# EAGLE design CHEAPO3 (EAGLE 6.3)
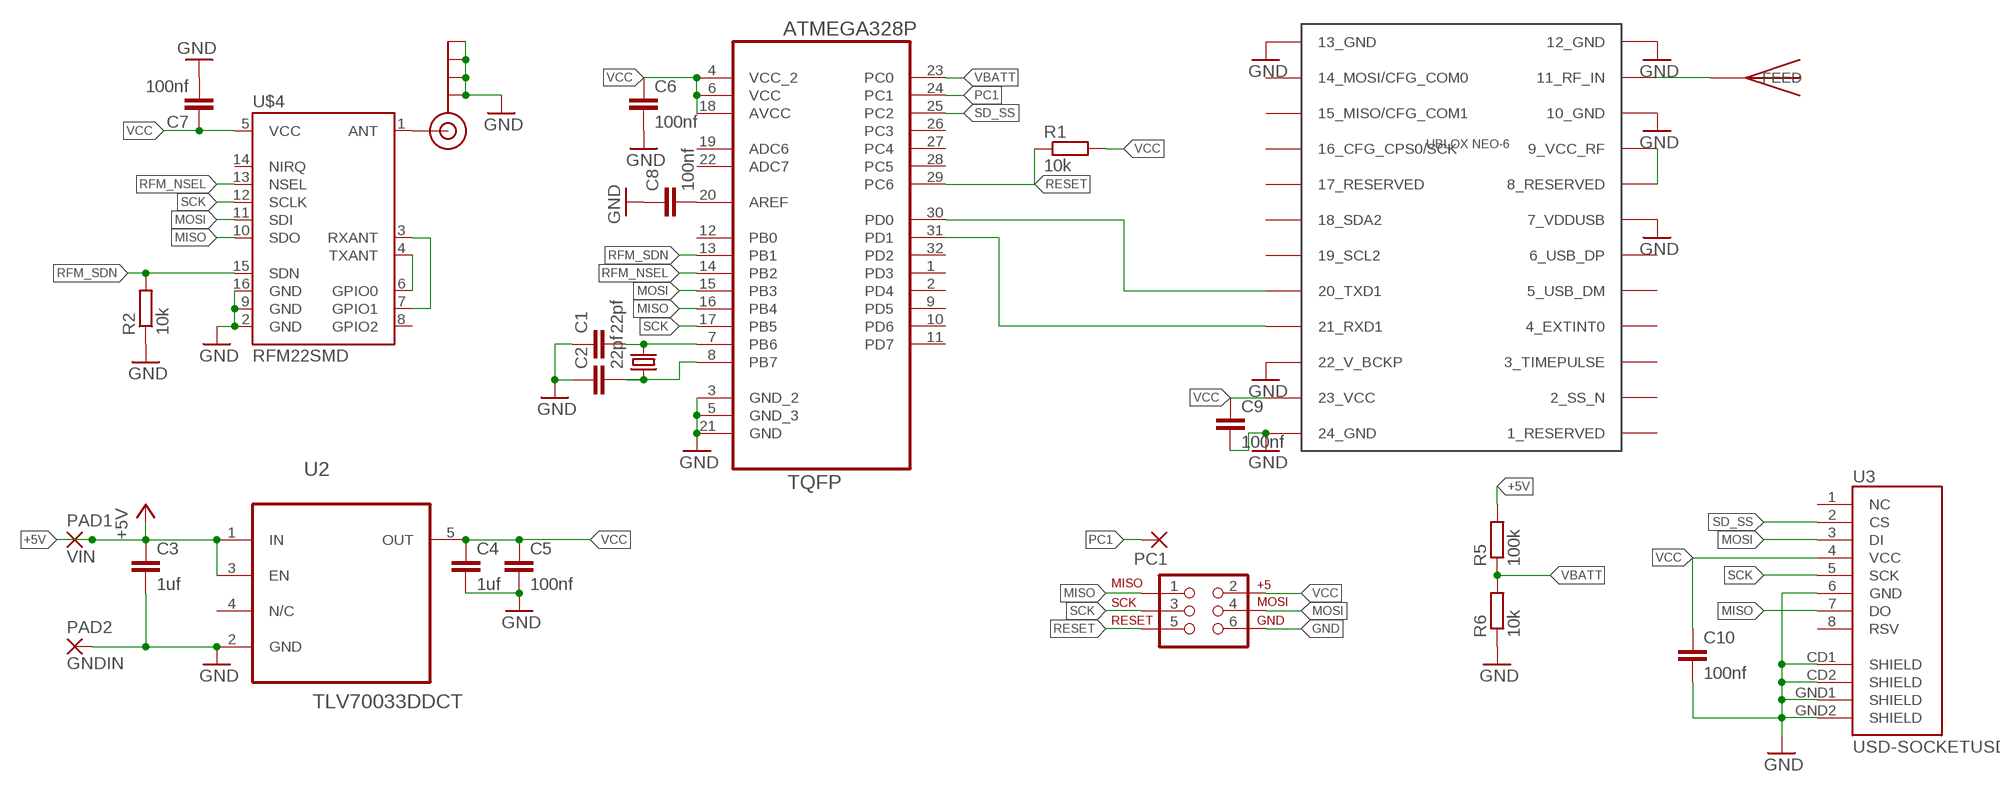
[diagram p0: schematic, sheet 1]

## Parts
C1  22pf  C-EUC0603  [C0603]
C2  22pf  C-EUC0603  [C0603]
C3  1uf  C-EUC0603  [C0603]
C4  1uf  C-EUC0603  [C0603]
C5  100nf  C-EUC0603  [C0603]
C6  100nf  C-EUC0603  [C0603]
C7  100nf  C-EUC0603  [C0603]
C8  100nf  C-EUC0603  [C0603]
C9  100nf  C-EUC0603  [C0603]
C10  100nf  C-EUC0603  [C0603]
J1  AVR_SPI_PRG_6PTH  [2X3]
J$1  SMA_EDGE  [SMA-EDGE]
PAD1  VIN  SMD2  [SMD1,27-2,54]
PAD2  GNDIN  SMD2  [SMD1,27-2,54]
PC1  SMD2  [SMD1,27-2,54]
R1  10k  R-EU_R0603  [R0603]
R2  10k  R-EU_R0603  [R0603]
R5  100k  R-EU_R0603  [R0603]
R6  10k  R-EU_R0603  [R0603]
U1  ATMEGA328P-AU  [QFP80P900X900X120-32N]
U2  TLV70033DDCT  [SOT95P280X110-5N]
U3  USD-SOCKETUSD  [USD-SOCKET-PP]
U$1  UBLOX_NEO-6  [UBLOX_NEO-6P]
U$2  ABRACON_ABM3_CRYSTALABM03_HC49  [ABM03_HC49]
U$3  JTI_ANTENNA-1575AT43A40  [JTI_ANTENNA-1575AT43A40]
U$4  RFM22SMD  [RFM22-XXX-S2]

## Nets
+5V: C3.1 PAD1.1(P) R5.2 U2.1(IN) U2.3(EN)
GND: C1.1 C2.1 C3.2 C4.2 C5.2 C6.2 C7.2 C8.1 C9.2 C10.2 J1.6 J$1.GND@0(GND) J$1.GND@1(GND) J$1.GND@2(GND) J$1.GND@3(GND) PAD2.1(P) R2.1 R6.1 U1.3(GND_2) U1.5(GND_3) U1.21(GND) U2.2(GND) U3.6(GND) U3.CD1(SHIELD) U3.CD2(SHIELD) U3.GND1(SHIELD) U3.GND2(SHIELD) U$1.7_VDDUSB U$1.10_GND U$1.12_GND U$1.13_GND U$1.22_V_BCKP U$1.24_GND U$4.2(GND) U$4.9(GND) U$4.16(GND)
MISO: J1.1 U1.16(PB4) U3.7(DO) U$4.10(SDO)
MOSI: J1.4 U1.15(PB3) U3.3(DI) U$4.11(SDI)
N$1: C1.2 U1.7(PB6) U$2.2
N$2: C2.2 U1.8(PB7) U$2.1
N$3: U$4.4(TXANT) U$4.6(GPIO0)
N$4: U$4.3(RXANT) U$4.7(GPIO1)
N$5: U$1.8_RESERVED U$1.9_VCC_RF
N$6: U$1.11_RF_IN U$3.FEED
N$7: C8.2 U1.20(AREF)
N$8: J$1.SIG(SIGNAL) U$4.1(ANT)
N$9: U1.30(PD0) U$1.20_TXD1
N$10: U1.31(PD1) U$1.21_RXD1
PC1: PC1.1(P) U1.24(PC1)
RESET: J1.5 R1.1 U1.29(PC6)
RFM_NSEL: U1.14(PB2) U$4.13(NSEL)
RFM_SDN: R2.2 U1.13(PB1) U$4.15(SDN)
SCK: J1.3 U1.17(PB5) U3.5(SCK) U$4.12(SCLK)
SD_SS: U1.25(PC2) U3.2(CS)
VBATT: R5.1 R6.2 U1.23(PC0)
VCC: C4.1 C5.1 C6.1 C7.1 C9.1 C10.1 J1.2 R1.2 U1.4(VCC_2) U1.6(VCC) U1.18(AVCC) U2.5(OUT) U3.4(VCC) U$1.23_VCC U$4.5(VCC)
Unconnected: U1.1(PD3) U1.2(PD4) U1.9(PD5) U1.10(PD6) U1.11(PD7) U1.12(PB0) U1.19(ADC6) U1.22(ADC7) U1.26(PC3) U1.27(PC4) U1.28(PC5) U1.32(PD2) U2.4(N/C) U3.1(NC) U3.8(RSV) U$1.1_RESERVED U$1.2_SS_N U$1.3_TIMEPULSE U$1.4_EXTINT0 U$1.5_USB_DM U$1.6_USB_DP U$1.14_MOSI/CFG_COM0 U$1.15_MISO/CFG_COM1 U$1.16_CFG_CPS0/SCK U$1.17_RESERVED U$1.18_SDA2 U$1.19_SCL2 U$4.8(GPIO2) U$4.14(NIRQ)

## Library data of the parts
C1-C10 = rcl:C-EU: CAPACITOR, European symbol
J1 = SparkFun-Connectors:AVR_SPI_PRG_6: AVR ISP 6 Pin This is the reduced ISP connector for AVR programming. Common on Arduino. This footprint will take up less PCB space and can be used with a 10-pin to 6-pin adapter such as SKU: BOB-08508
J$1 = SparkFun-Connectors:SMA_EDGE: SMA Antenna Connector End launch SMA connector. The paste layer has been removed so that the connector can be hand soldered onto the board after reflow.
PAD1 PAD2 PC1 = wirepad:SMD2: SMD PAD
R1 R2 R5 R6 = rcl:R-EU_: RESISTOR, European symbol
U1 = Ava:ATMEGA328P-AU; DESCRIPTION: 8-bit Microcontroller with In-System Programmable Flash; MPN: ATMEGA328P-AU; OC_FARNELL: 1715486; OC_NEWARK: 14R4631; PACKAGE: TQFP-32; SUPPLIER: Atmel
U2 = Texas Instruments_By_element14_Batch_1:TLV70033DDCT: 200-mA, Low-IQ, Low-Dropout Regulator for Portable Devices; MPN: TLV70033DDCT; OC_FARNELL: 1778230; OC_NEWARK: 50R4446; PACKAGE: TSOT-23-5; SUPPLIER: Texas Instruments
U3 = CSEDIT-SparkFun-Old:USD-SOCKET: microSD Socket Push-push type uSD socket. Schematic element and footprint production proven. Spark Fun Electronics SKU : PRT-00127. tDoc lines correctly indicate media card edge positions when inserting (unlocked, locked, depressed).
U$1 = Ava:UBLOX_NEO-6: UBLOX NEO-6 GPS MODULE Author Anthony Stirk / http://ava.upuaut.net http://www.u-blox.com/images/downloads/Product_Docs/LEA-6_NEO-6_MAX-6_HardwareIntegrationManual_%28GPS.G6-HW-09007%29.pdf http://www.u-blox.com/images/downloads/Product_Docs/NEO-6_DataSheet_%28GPS.G6-HW-09005%29.pdf
U$2 = Ava:ABRACON_ABM3_CRYSTAL
U$3 = Ava:JTI_ANTENNA-1575AT43A40
U$4 = SparkFun-RF:RFM22: The RFM22 is a low-power, low cost radio that is capable of operating in the 434MHz and 900MHz open bands. It's frequency is software defined and there are some very good libraries written for it.

## Board
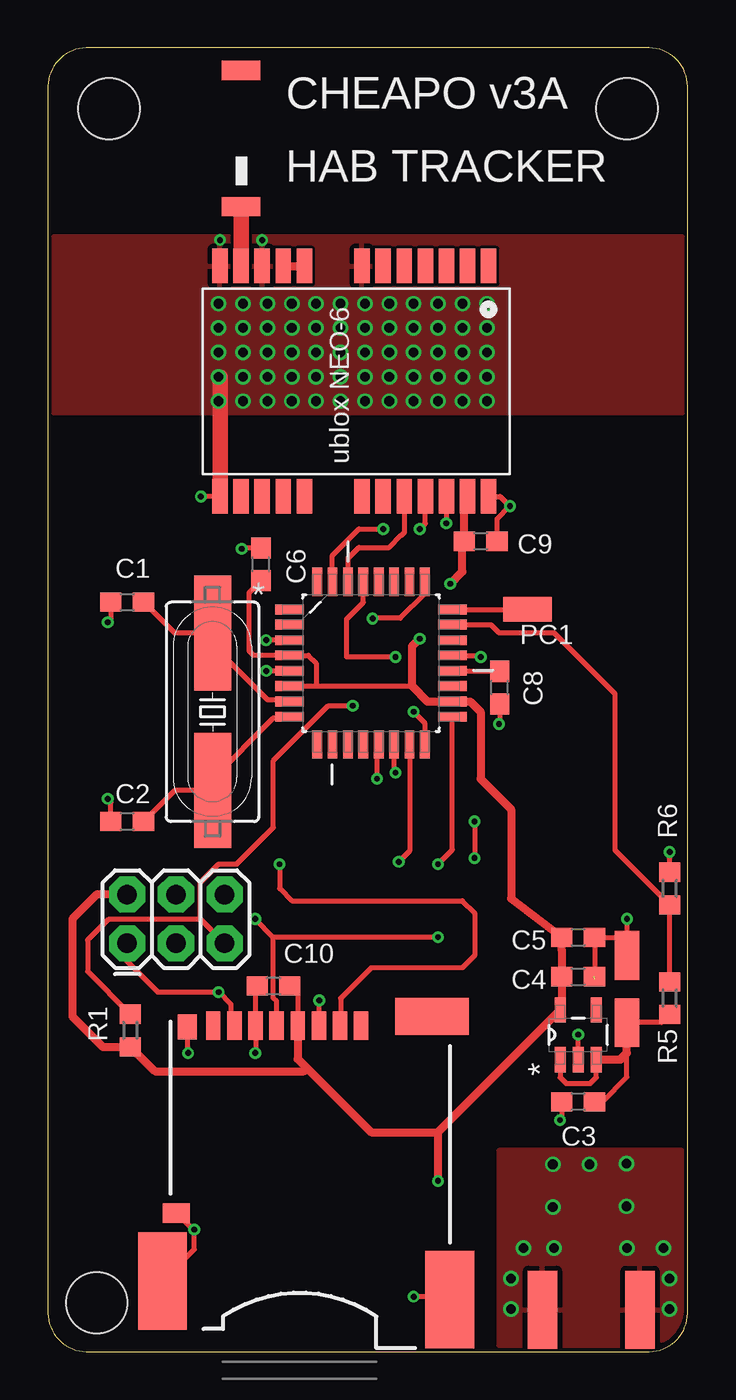
[diagram p1: board, top side]
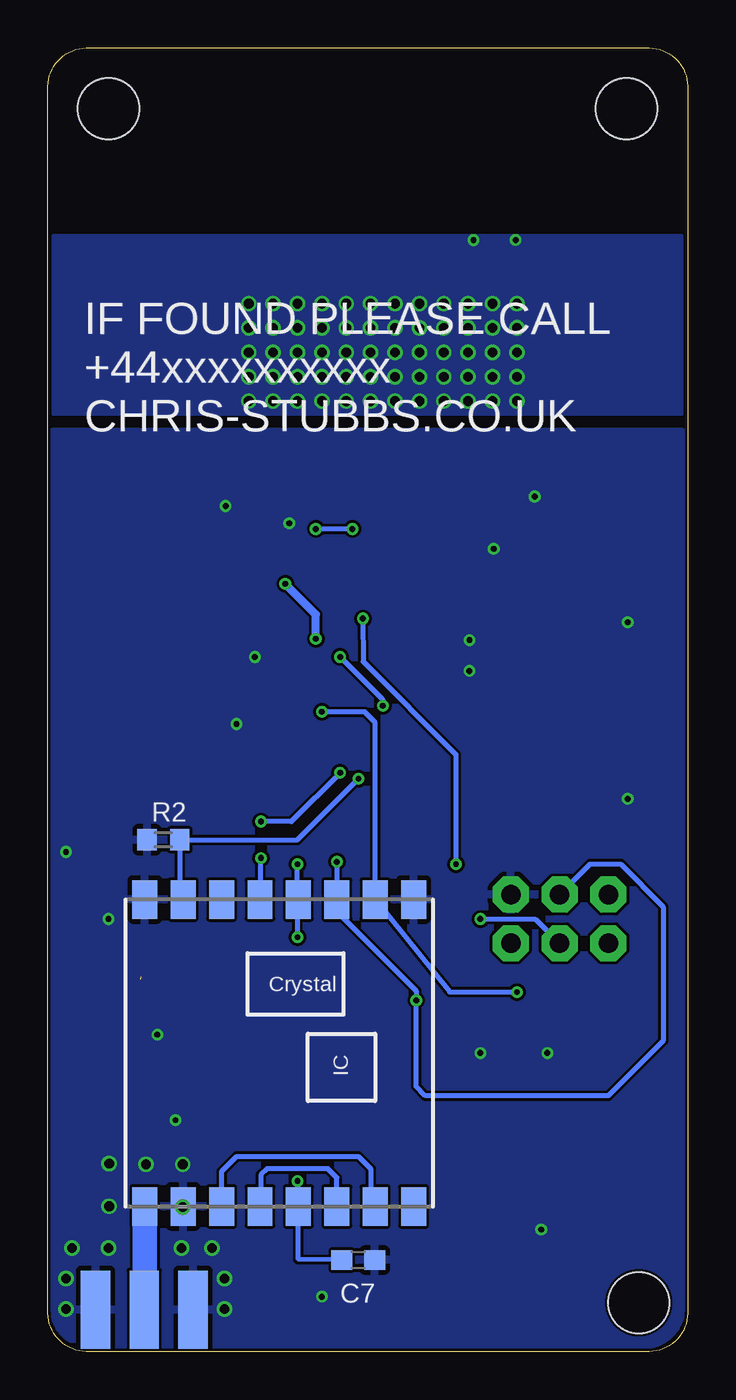
[diagram p2: board, bottom side, seen from below]

Size 33.32 x 67.93 mm. Coordinates in mm from the lower left corner, seen from the top.
Outline: 31.32,67.93 2,67.93 arc90 0,65.93 0,2 arc90 2,0 31.32,0 arc90 33.32,2 33.32,65.93 arc90 31.32,67.93
Copper layers (1*16): Top 0.035mm / dielectric 1.5mm / Bottom 0.035mm
Design rules "Hackvana": minimum track width 6mil, minimum drill 0.3mm, track to track 6mil, track to pad 6mil, pad to pad 6mil, via to via 6mil, smd to smd 0mil, copper to edge 6mil, drill to drill 6mil, minimum pad ring 10mil, minimum via ring 6mil, stop-mask expansion 2mil, vias tented up to drill 100mil, thermal gap 10mil
Holes 3.2 mm at 2.54,2.54 3.17,64.77 30.16,64.77

### Footprints (pad centres in the part's own frame; a part is rotated, then mirrored left to right if it is on the bottom)
C0603 = smd 1.1 x 1: 1 -0.85,0; 2 0.85,0
2X3 = drill 1.016 pad 1.88 octagon: 1 0,0; 2 0,2.54; 3 2.54,0; 4 2.54,2.54; 5 5.08,0; 6 5.08,2.54
SMA-EDGE = smd 1.524 x 4.064: GND@0 0,0; GND@1 5.08,0; SIG 2.54,0 | smd 1.524 x 4.064 bottom: GND@2 0,0; GND@3 5.08,0
SMD1,27-2,54 = smd 1.27 x 2.54: 1 0,0
R0603 = smd 1 x 1.1: 1 -0.85,0; 2 0.85,0
QFP80P900X900X120-32N = smd 1.473 x 0.508: 1 -4.242,2.794; 2 -4.242,2.007; 3 -4.242,1.194; 4 -4.242,0.406; 5 -4.242,-0.406; 6 -4.242,-1.194; 7 -4.242,-2.007; 8 -4.242,-2.794; 17 4.242,-2.794; 18 4.242,-2.007; 19 4.242,-1.194; 20 4.242,-0.406; 21 4.242,0.406; 22 4.242,1.194; 23 4.242,2.007; 24 4.242,2.794 | smd 0.508 x 1.473: 9 -2.794,-4.242; 10 -2.007,-4.242; 11 -1.194,-4.242; 12 -0.406,-4.242; 13 0.406,-4.242; 14 1.194,-4.242; 15 2.007,-4.242; 16 2.794,-4.242; 25 2.794,4.242; 26 2.007,4.242; 27 1.194,4.242; 28 0.406,4.242; 29 -0.406,4.242; 30 -1.194,4.242; 31 -2.007,4.242; 32 -2.794,4.242
SOT95P280X110-5N = smd 1.321 x 0.559: 1 -1.295,0.94; 2 -1.295,0; 3 -1.295,-0.94; 4 1.295,-0.94; 5 1.295,0.94
USD-SOCKET-PP = smd 0.75 x 1.5: 1 3.293,14.122; 2 2.193,14.122; 3 1.093,14.122; 4 -0.007,14.122; 5 -1.107,14.122; 6 -2.207,14.122; 7 -3.307,14.122; 8 -4.407,14.122 | smd 1 x 1.3: CD1 -5.757,14.072 | smd 1.4 x 1: CD2 -6.332,4.362 | smd 2.54 x 5.08: GND1 -7.052,0.803; GND2 7.918,-0.152 | smd 3.81 x 1.93: P$1 6.985,14.605
UBLOX_NEO-6P = smd 1.8 x 0.8: 1_RESERVED 6.4,-7.4; 2_SS_N 6.4,-6.3; 3_TIMEPULSE 6.4,-5.2; 4_EXTINT0 6.4,-4.1; 5_USB_DM 6.4,-3; 6_USB_DP 6.4,-1.9; 7_VDDUSB 6.4,-0.8; 8_RESERVED 6.4,2.2; 9_VCC_RF 6.4,3.3; 10_GND 6.4,4.4; 11_RF_IN 6.4,5.5; 12_GND 6.4,6.6; 13_GND -5.6,6.6; 14_MOSI/CFG_COM0 -5.6,5.5; 15_MISO/CFG_COM1 -5.6,4.4; 16_CFG_CPS0/SCK -5.6,3.3; 17_RESERVED -5.6,2.2; 18_SDA2 -5.6,-0.8; 19_SCL2 -5.6,-1.9; 20_TXD1 -5.6,-3; 21_RXD1 -5.6,-4.1; 22_V_BCKP -5.6,-5.2; 23_VCC -5.6,-6.3; 24_GND -5.6,-7.4
ABM03_HC49 = smd 6 x 1.93: 1 -4.1,0; 2 4.1,0
JTI_ANTENNA-1575AT43A40 = smd 1 x 2: FEED -3.175,0; NC 3.925,0
RFM22-XXX-S2 = smd 2 x 1.3: 1 -8,7; 2 -8,5; 3 -8,3; 4 -8,1; 5 -8,-1; 6 -8,-3; 7 -8,-5; 8 -8,-7; 9 8,-7; 10 8,-5; 11 8,-3; 12 8,-1; 13 8,1; 14 8,3; 15 8,5; 16 8,7

### Placement (x,y rotation side)
C1  4.13,39.05 0 top
C2  4.13,27.62 0 top
C3  27.62,13.02 180 top
C4  27.62,19.53 0 top
C5  27.62,21.59 0 top
C6  11.1,41.02 90 top
C7  17.15,4.77 0 bottom
C8  23.54,34.6 90 top
C9  22.54,42.23 0 top
C10  11.75,19.05 180 top
J1  4.13,21.27 0 top
J$1  30.84,2.18 0 bottom
PAD1  30.16,17.14 0 top
PAD2  30.16,20.64 0 top
PC1  24.98,38.69 90 top
R1  4.29,16.73 270 top
R2  27.3,26.67 0 bottom
R5  32.38,18.41 270 top
R6  32.38,24.13 270 top
U1  16.83,35.88 0 top
U2  27.62,16.51 90 top
U3  13.02,2.86 0 top
U$1  15.56,50.16 90 top
U$2  8.57,33.34 90 top
U$3  10.05,62.83 90 top
U$4  21.27,15.56 90 bottom

### Tracks (layer width: path | path; a pad name or v marks a point on that pad's centre or on a via)
+5V
  Top 0.254: U2.1 26.68,14.28 26.99,13.97 28.26,13.97 28.56,14.28 U2.3 | C3.1 28.89,13.02 30.16,14.29 30.16,15.56 | R5.2 31.96,17.14 PAD1.1
  Top 0.406: U2.3 29.82,15.21 30.16,15.56 PAD1.1
GND  (via drill 0.3, 0.5)  (1 unrouted)
  Top 0.254: 28.47,19.39 C5.2 30.16,21.59 | U2.2 v27.62,16.51 | C3.2 26.77,12.17 v26.67,12.06 | U3.CD1 7.26,15.6 v7.3,15.56 | v10.79,15.56 10.81,15.57 U3.6 10.81,18.96 C10.2 | U3.GND1 7.62,5.32 v7.62,6.35 7.55,6.35 U3.CD2 | U3.GND2 20.78,2.86 v19.05,2.86 | C8.1 23.54,32.74 v23.5,32.7 | U1.21 22.45,36.28 v22.54,36.2 | U1.5 v11.37,35.47 | U1.3 v11.37,37.07 v11.36,37.07 | C2.1 3.28,28.64 v3.11,28.8 | C1.1 3.28,38.17 v3.11,38.01 | C6.2 10.13,41.87 v10.09,41.84 | U$1.13_GND v7.97,44.56 v7.96,44.56 | U$1.24_GND 23.56,44.56 v24.06,44.06 23.39,43.39 C9.2 | U$1.22_V_BCKP v20.76,43.17 v20.75,43.16 | R6.1 v32.38,26.04 | v30.16,22.54 30.16,21.59 | 30.16,21.59 PAD2.1
  Top 0.813: U$1.13_GND 8.97,50.78
  other vias: 8.96,57.92 11.16,57.92 8.89,54.61 8.89,53.34 8.89,52.07 8.89,50.8 8.89,49.53 10.16,54.61 10.16,53.34 10.16,52.07 10.16,50.8 10.16,49.53 24.13,2.22 32.38,2.22 24.13,3.81 24.77,5.4 26.35,5.4 30.16,5.4 32.38,3.81 32.07,5.4 26.3,7.53 30.13,7.57 11.43,54.61 11.43,53.34 11.43,52.07 11.43,50.8 11.43,49.53 12.7,54.61 12.7,53.34 12.7,52.07 12.7,50.8 12.7,49.53 13.97,54.61 13.97,53.34 13.97,52.07 13.97,50.8 13.97,49.53 15.24,54.61 15.24,53.34 15.24,52.07 15.24,50.8 15.24,49.53 16.51,54.61 16.51,53.34 16.51,52.07 16.51,50.8 16.51,49.53 17.78,54.61 17.78,53.34 17.78,52.07 17.78,50.8 17.78,49.53 19.05,54.61 19.05,53.34 19.05,52.07 19.05,50.8 19.05,49.53 20.32,54.61 20.32,53.34 20.32,52.07 20.32,50.8 20.32,49.53 21.59,54.61 21.59,53.34 21.59,52.07 21.59,50.8 21.59,49.53 22.86,54.61 22.86,53.34 22.86,52.07 22.86,50.8 22.86,49.53 26.3,9.75 30.13,9.79 28.2,9.75
  pour Bottom: 0.32,47.94 0.32,2.32 arc90 2.32,0.32 31.02,0.32 arc90 33.02,2.32 33.02,47.94
  pour Top: 0.32,48.9 0.32,58.1 33.02,58.1 33.02,48.9
  pour Top: 23.5,0.32 31.02,0.32 arc90 33.02,2.32 33.02,10.48 23.5,10.48
  pour Bottom: 0.32,58.1 33.02,58.1 33.02,48.9 0.32,48.9
MISO  (via drill 0.3)
  Top 0.254: J1.1 4.13,20.32 5.71,18.73 v8.89,18.73 9.53,18.1 9.53,17.16 U3.7 | v19.05,33.34 19.62,32.77 U1.16
  Bottom 0.254: v19.05,33.34 16.83,33.34 16.27,32.78 U$4.10 12.4,18.73 v8.89,18.73
MOSI  (via drill 0.3)
  Top 0.254: U1.15 18.83,26.08 v18.27,25.52 | v14.13,18.3 14.11,18.27 U3.3
  Bottom 0.254: v18.27,25.52 18.27,22.92 | 18.27,22.92 U$4.11 | 18.27,22.92 14.13,18.79 v14.13,18.3 14.13,13.82 13.65,13.34 4.13,13.34 1.27,16.19 1.27,23.18 3.49,25.4 5.08,25.4 J1.4
N$1
  Top 0.254: U1.7 12.48,33.97 11.43,33.97 8.57,36.83 U$2.2 6.59,37.44 C1.2
N$2
  Top 0.254: U1.8 12.52,33.02 11.75,33.02 8.57,29.84 U$2.1 6.59,29.24 C2.2
N$3
  Bottom 0.254: U$4.6 18.27,9.06 18.73,9.53 21.91,9.53 22.23,9.21 22.23,7.61 U$4.4
N$4
  Bottom 0.254: U$4.3 24.27,9.38 23.5,10.16 17.14,10.16 16.51,9.53 16.51,7.79 U$4.7
N$5
  Top 0.406: U$1.9_VCC_RF U$1.8_RESERVED
N$6
  Top 0.813: U$1.11_RF_IN U$3.FEED
N$7
  Top 0.254: U1.20 23.51,35.47 C8.2
N$8
  Bottom 1.27: U$4.1 28.27,2.21 J$1.SIG
N$9
  Top 0.254: U1.30 15.63,41.35 16.19,41.91 17.78,41.91 18.41,42.55 18.42,42.55 18.57,42.7 18.57,44.55 U$1.20_TXD1
N$10  (via drill 0.3)
  Top 0.254: U1.31 14.82,41.49 16.19,42.86 v17.46,42.86 | v19.37,42.86 19.66,43.15 U$1.21_RXD1
  Bottom 0.254: v17.46,42.86 v19.37,42.86
PC1
  Top 0.254: U1.24 24.96,38.67 PC1.1
RESET  (via drill 0.3)
  Top 0.254: 7.94,22.54 3.17,22.54 2.07,21.44 2.07,19.8 R1.1 | 7.94,22.54 J1.5 | 7.94,22.54 7.94,24.45 8.89,25.4 9.84,25.4 11.75,27.3 11.75,30.8 14.61,33.66 v15.88,33.66 | v18.1,36.2 15.56,36.2 15.56,38.17 16.43,39.04 U1.29
  Bottom 0.254: v15.88,33.66 15.88,33.97 v18.1,36.2
RFM_NSEL  (via drill 0.3)
  Top 0.254: U1.14 18.02,30.24 v18.1,30.16 | v22.23,27.62 v22.23,25.72
  Bottom 0.254: v18.1,30.16 20.64,27.62 v22.23,27.62 | v22.23,25.72 22.27,25.67 U$4.13
RFM_SDN  (via drill 0.3)
  Top 0.254: v17.14,29.84 17.14,31.55 U1.13
  Bottom 0.254: U$4.15 26.45,23.74 R2.2 20.32,26.67 v17.14,29.84
SCK  (via drill 0.3)
  Top 0.254: U3.5 11.91,18.25 11.75,18.41 11.75,21.59 | 11.75,21.59 v10.79,22.54 | v20.32,25.4 21.07,26.15 U1.17 | v20.32,21.59 11.75,21.59
  Bottom 0.254: v10.79,22.54 7.94,22.54 J1.3 | v20.32,25.4 20.32,23.61 U$4.12 20.32,23.51 v20.32,21.59
SD_SS  (via drill 0.3)
  Top 0.254: U1.25 19.63,39.48 18.36,38.22 16.93,38.22 v16.91,38.2 | v12.06,25.4 12.06,24.13 12.7,23.5 21.59,23.5 22.23,22.86 22.23,20.64 21.59,20 16.83,20 15.24,18.41 15.24,17.01 U3.2
  Bottom 0.254: v16.91,38.2 16.91,35.95 12.06,31.11 v12.06,25.4
VBATT
  Top 0.254: R5.1 R6.2 29.53,26.14 29.53,34.29 26.35,37.47 23.5,37.47 23.08,37.88 U1.23
VCC  (via drill 0.3)
  Top 0.254: 26.76,19.38 C4.1 | 26.77,17.89 U2.5 | C10.1 13.01,18.64 U3.4 | U1.6 13.97,34.68 | 13.97,34.68 18.97,34.68 | 21.05,33.87 U1.18 | 13.97,34.68 13.97,35.88 13.56,36.28 U1.4 10.71,36.28 10.48,36.51 10.48,39.55 C6.1 | 21.59,42.12 C9.1 | 21.69,44.4 U$1.23_VCC | 20.31,11.43 20.32,11.44 | R1.2
  Top 0.406: 26.76,19.38 26.76,20.95 C5.1 24.13,23.6 24.13,28.26 22.54,29.84 22.54,33.34 22.01,33.87 U1.18 | C4.1 26.77,17.89 | v20.32,8.89 20.32,11.44 U2.5 | 21.05,33.87 19.77,33.87 18.97,34.68 18.97,36.75 v19.37,37.15 | 21.59,42.12 21.59,40.64 v20.95,40.01 | C9.1 21.69,44.4 | U3.4 13.01,15.25 13.49,14.76 | 13.49,14.76 16.83,11.43 20.31,11.43 | 13.49,14.76 13.34,14.61 5.57,14.61 R1.2 | J1.2 2.54,23.81 1.27,22.54 1.27,17.46 2.86,15.88 R1.2
  Bottom 0.254: C7.1 20.27,4.82 U$4.5 20.27,8.84 v20.32,8.89
  Bottom 0.406: v19.37,37.15 19.37,38.42 v20.95,40.01

### Text on the board
tPlace: CHEAPO v3A | HAB TRACKER
bPlace: IF FOUND PLEASE CALL | +44xxxxxxxxxx | CHRIS-STUBBS.CO.UK